# Altium schematic sheet Receiver_Design_PCB.SchDoc
size A3; SheetNumber: 1; SheetTotal: 1
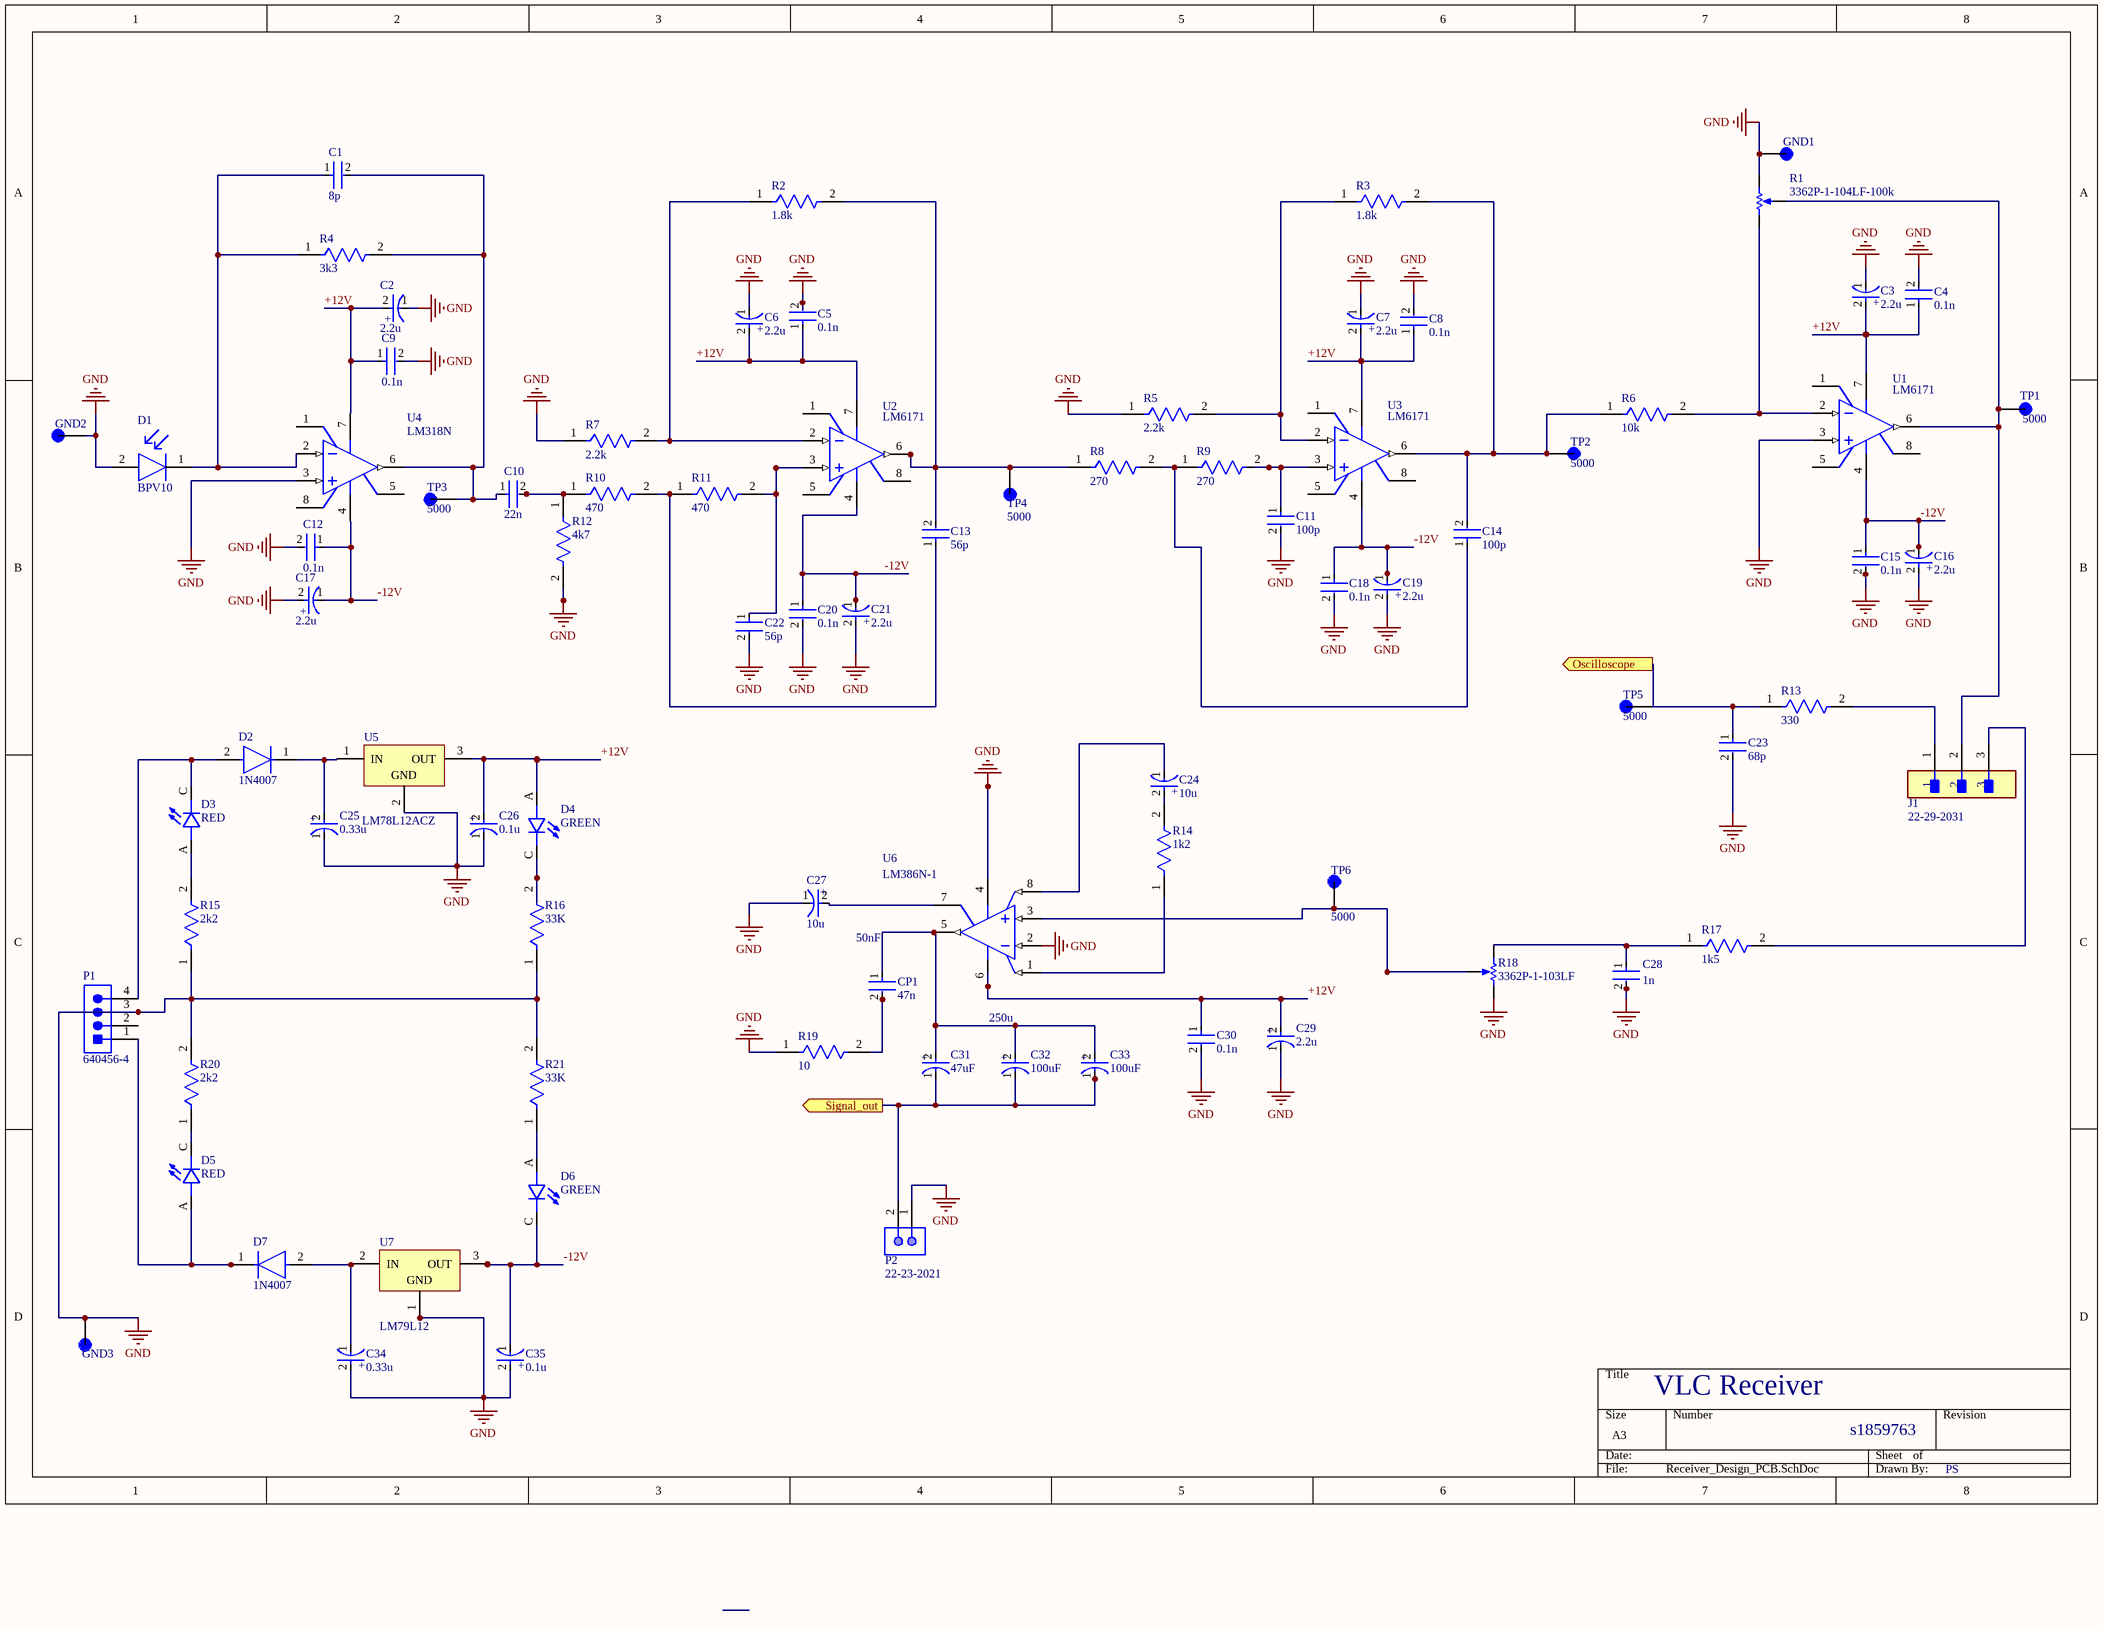
[diagram p0: Receiver_Design_PCB.SchDoc]

## Parts
C1  8p  [FP-K15H5-MFG]
C2  2.2u  [FP-TAP106K016SCS-MFG]
C3  2.2u  [FP-TAP106K016SCS-MFG]
C4  0.1n  [FP-K15H5-MFG]
C5  0.1n  [FP-K15H5-MFG]
C6  2.2u  [FP-TAP106K016SCS-MFG]
C7  2.2u  [FP-TAP106K016SCS-MFG]
C8  0.1n  [FP-K15H5-MFG]
C9  0.1n  [FP-K15H5-MFG]
C10  22n  [FP-K15H5-MFG]
C11  100p  [FP-K15H5-MFG]
C12  0.1n  [FP-K15H5-MFG]
C13  56p  [FP-K15H5-MFG]
C14  100p  [FP-K15H5-MFG]
C15  0.1n  [FP-K15H5-MFG]
C16  2.2u  [FP-TAP106K016SCS-MFG]
C17  2.2u  [FP-TAP106K016SCS-MFG]
C18  0.1n  [FP-K15H5-MFG]
C19  2.2u  [FP-TAP106K016SCS-MFG]
C20  0.1n  [FP-K15H5-MFG]
C21  2.2u  [FP-TAP106K016SCS-MFG]
C22  56p  [FP-K15H5-MFG]
C23  68p  [FP-K15H5-MFG]
C24  10u  [FP-RAD-TH-D_8_0_5-L_11_5-MFG]
C25  0.33u  [FP-TAP106K016SCS-MFG]
C26  0.1u  [FP-TAP106K016SCS-MFG]
C27  10u  [FP-RAD-TH-D_8_0_5-L_11_5-MFG]
C28  1n  [FP-K15H5-MFG]
C29  2.2u  [FP-TAP106K016SCS-MFG]
C30  0.1n  [FP-K15H5-MFG]
C31  47uF  [FP-RAD-TH-D_8_0_5-L_11_5-MFG]
C32  100uF  [FP-EEU-FR1H101B-MFG]
C33  100uF  [FP-EEU-FR1H101B-MFG]
C34  0.33u  [FP-TAP106K016SCS-MFG]
C35  0.1u  [FP-TAP106K016SCS-MFG]
CP1  47n  [FP-R82DC4100DQ60J-MFG]
D1  BPV10  [FP-6_544-5185_02-4-MFG]
D2  1N4007  [FP-1N4007-MFG]
D3  RED  [LEDRD254W57D500H1070]
D4  GREEN  [LEDRD254W57D500H1070]
D5  RED  [LEDRD254W57D500H1070]
D6  GREEN  [LEDRD254W57D500H1070]
D7  1N4007  [FP-1N4007-MFG]
GND1  (no value)  [KEYSTONE_5000]
GND2  (no value)  [KEYSTONE_5000]
GND3  (no value)  [KEYSTONE_5000]
J1  22-29-2031  [FP-22-29-2031-MFG]
P1  640456-4  [TECO-640456-4]
P2  22-23-2021  [MOLX-22-23-2021_V]
R1  3362P-1-104LF-100k  [BOUR-3362P]
R2  1.8k  [FP-MRS25-MFG]
R3  1.8k  [FP-MRS25-MFG]
R4  3k3  [FP-MRS25-MFG]
R5  2.2k  [FP-MRS25-MFG]
R6  10k  [FP-MRS25-MFG]
R7  2.2k  [FP-MRS25-MFG]
R8  270  [FP-MRS25-MFG]
R9  270  [FP-MRS25-MFG]
R10  470  [FP-MRS25-MFG]
R11  470  [FP-MRS25-MFG]
R12  4k7  [FP-MRS25-MFG]
R13  330  [FP-MRS25-MFG]
R14  1k2  [FP-MRS25-MFG]
R15  2k2  [FP-MRS25-MFG]
R16  33K  [FP-MRS25-MFG]
R17  1k5  [FP-MRS25-MFG]
R18  3362P-1-103LF  [BOUR-3362P]
R19  10  [FP-MRS25-MFG]
R20  2k2  [FP-MRS25-MFG]
R21  33K  [FP-MRS25-MFG]
TP1  5000  [KEYSTONE_5000]
TP2  5000  [KEYSTONE_5000]
TP3  5000  [KEYSTONE_5000]
TP4  5000  [KEYSTONE_5000]
TP5  5000  [KEYSTONE_5000]
TP6  5000  [KEYSTONE_5000]
U1  LM6171  [P0008A]
U2  LM6171  [P0008A]
U3  LM6171  [P0008A]
U4  LM318N  [P0008A]
U5  LM78L12ACZ  [TO220]
U6  LM386N-1  [TI-P8]
U7  LM79L12  [NDE0003A]

## Ports
Oscilloscope (out), Signal_out (out)

## Nets
GND: C2.1(C) C3.1(C) C4.2 C5.2 C6.1(C) C7.1(C) C8.2 C9.2 C11.2 C12.2 C15.2 C16.2(A) C17.2(A) C18.2 C19.2(A) C20.2 C21.2(A) C22.2 C23.2 C25.1(C) C26.1(C) C27.1(C) C28.2 C29.1(C) C30.2 C34.2(A) C35.2(A) D1.2(A) GND1.TP GND2.TP GND3.TP P1.3 P2.1 R1.3(CW) R5.1 R7.1 R12.2 R15.1 R16.1 R18.3(CW) R19.1 R20.2 R21.2 U1.3(IN+) U4.3(IN+) U5.2(GND) U6.2(IN-) U6.4(GND) U7.1(GND)
+12V: C2.2(A) C3.2(A) C4.1 C5.1 C6.2(A) C7.2(A) C8.1 C9.1 C26.2(A) C29.2(A) C30.1 D4.A U1.7(V+) U2.7(V+) U3.7(V+) U4.7(V+) U5.3(OUT) U6.6(VS)
-12V: C12.1 C15.1 C16.1(C) C17.1(C) C18.1 C19.1(C) C20.1 C21.1(C) C35.1(C) D6.C U1.4(V-) U2.4(V-) U3.4(V-) U4.4(V-) U7.3(OUT)
Oscilloscope: C23.1 R13.1 TP5.TP ; port Oscilloscope
Signal_out: C31.1(C) C32.1(C) C33.1(C) P2.2 ; port Signal_out
NetC1_1: C1.1 D1.1(C) R4.1 U4.2(IN-)
NetC1_2: C1.2 C10.1 R4.2 TP3.TP U4.6(OUT)
NetC10_2: C10.2 R10.1 R12.1
NetC11_1: C11.1 R9.2 U3.3(IN+)
NetC13_1: C13.1 R10.2 R11.1
NetC13_2: C13.2 R2.2 R8.1 TP4.TP U2.6(OUT)
NetC14_1: C14.1 R8.2 R9.1
NetC14_2: C14.2 R3.2 R6.1 TP2.TP U3.6(OUT)
NetC22_1: C22.1 R11.2 U2.3(IN+)
NetC24_1: C24.1(C) U6.8(GAIN)
NetC24_2: C24.2(A) R14.2
NetC25_2: C25.2(A) D2.1(C) U5.1(IN)
NetC27_2: C27.2(A) U6.7(BYPASS)
NetC28_1: C28.1 R17.1 R18.1(CCW)
NetC31_2: C31.2(A) C32.2(A) C33.2(A) CP1.1 U6.5(VOUT)
NetC34_1: C34.1(C) D7.2(A) U7.2(IN)
NetCP1_2: CP1.2 R19.2
NetD2_2: D2.2(A) D3.C P1.4
NetD3_A: D3.A R15.2
NetD4_C: D4.C R16.2
NetD5_A: D5.A D7.1(C) P1.1
NetD5_C: D5.C R20.1
NetD6_A: D6.A R21.1
NetJ1_1: J1.1 R13.2
NetJ1_2: J1.2 R1.2(S) TP1.TP U1.6(OUT)
NetJ1_3: J1.3 R17.2
NetR1_1: R1.1(CCW) R6.2 U1.2(IN-)
NetR2_1: R2.1 R7.2 U2.2(IN-)
NetR3_1: R3.1 R5.2 U3.2(IN-)
NetR14_1: R14.1 U6.1(GAIN)
NetR18_2: R18.2(S) TP6.TP U6.3(IN+)

Not connected (* = marked no-connect by the designer): P1 2; U1 1(NC) 5(NC) 8(NC); U2 1(NC) 5(NC) 8(NC); U3 1(NC) 5(NC) 8(NC); U4 1(BAL/COMP1) 5(BAL/COMP3) 8(COMP2)

## Notes on the sheet
- 50nF
- 250u
- VLC Receiver
- s1859763
- PS
- (in symbol CMP-04424-000616-1) +
- (in symbol CMP-05427-000020-1) +
- (in symbol CMP-05427-001162-1) +

## Library data of the parts
C1 C4 C5 C8-C12 C14 C15 C18 C20 C28 C30 = CMP-02417-000078-1: CAP CER 0.1UF 50V X7R RADIAL; Tolerance: 10%; Dielectric Material: Ceramic; Lead Length: 30mm; Lead Diameter: 0.5mm; Lead/Base Style: Formed Leads; Diameter: 500um; Max Operating Temperature: 125°C; Case/Package: Dipped; Dielectric: X7R; Lead Free: Lead Free; Construction: RADIAL; Voltage: 50V; Thickness: 2.6mm; Min Operating Temperature: -55°C; Lead Pitch: 5mm; Height: 4mm; Radiation Hardening: No; Voltage Rating: 50V; Depth: 2.5mm; Voltage Rating (DC): 50V; Package Quantity: 1; Weight: 0.005644oz; Series: K; Mount: Through Hole; Termination: Radial; Height - Seated (Max): 0.257inch; Length: 4mm; Packaging: Tape and Reel; Width: 2.5mm; RoHS Compliant: Yes
  C1: Capacitance: 8p
  C4 C5 C8 C9 C12 C15 C18 C20 C30: Capacitance: 0.1n
  C10: Capacitance: 22n
  C11 C14: Capacitance: 100p
  C28: Capacitance: 1n
C2 C3 C6 C7 C16 C17 C19 C21 C26 C29 C35 = CMP-04424-000616-1: CAP TANT 10UF 10% 16V RADIAL; Dissipation Factor: 8%; Dielectric Material: Tantalum; Leakage Current: 1.2uA; Polarity: Polar; Voltage: 35V; Life (Hours): 1000Hour; ESR (Equivalent Series Resistance): 3.2R; Lead Diameter: 0.5mm; Capacitance: 0.33u; Packaging: Bulk; Min Operating Temperature: -55°C; RoHS Compliant: Yes; Construction: RADIAL; Length: 9mm; Number of Pins: 2; Height - Seated (Max): 0.354inch; Termination: Radial; Tolerance: 10%; Case/Package: Dipped; Voltage Rating (DC): 16V; Voltage Rating: 16V; Lead Pitch: 2.5mm; Size: 9mm; Lead Free: Lead Free; Mount: Through Hole; Height: 9mm; Max Operating Temperature: 125°C; Features: General Purpose; Diameter: 5mm; Radiation Hardening: No; Package Quantity: 1000; Series: TAP
C13 C22 = CMP-02417-000078-1: CAP CER 0.1UF 50V X7R RADIAL; Capacitance: 100p; Tolerance: 10%; Dielectric Material: Ceramic; Lead Length: 30mm; Lead Diameter: 0.5mm; Lead/Base Style: Formed Leads; Diameter: 500um; Max Operating Temperature: 125°C; Case/Package: Dipped; Dielectric: X7R; Lead Free: Lead Free; Construction: RADIAL; Voltage: 50V; Thickness: 2.6mm; Min Operating Temperature: -55°C; Lead Pitch: 5mm; Height: 4mm; Radiation Hardening: No; Voltage Rating: 50V; Depth: 2.5mm; Voltage Rating (DC): 50V; Package Quantity: 1; Weight: 0.005644oz; Series: K; Mount: Through Hole; Termination: Radial; Height - Seated (Max): 0.257inch; Length: 4mm; Packaging: Tape and Reel; Width: 2.5mm; RoHS Compliant: Yes
C23 = CMP-02417-000078-1: CAP CER 0.1UF 50V X7R RADIAL; Capacitance: 22p; Tolerance: 10%; Dielectric Material: Ceramic; Lead Length: 30mm; Lead Diameter: 0.5mm; Lead/Base Style: Formed Leads; Diameter: 500um; Max Operating Temperature: 125°C; Case/Package: Dipped; Dielectric: X7R; Lead Free: Lead Free; Construction: RADIAL; Voltage: 50V; Thickness: 2.6mm; Min Operating Temperature: -55°C; Lead Pitch: 5mm; Height: 4mm; Radiation Hardening: No; Voltage Rating: 50V; Depth: 2.5mm; Voltage Rating (DC): 50V; Package Quantity: 1; Weight: 0.005644oz; Series: K; Mount: Through Hole; Termination: Radial; Height - Seated (Max): 0.257inch; Length: 4mm; Packaging: Tape and Reel; Width: 2.5mm; RoHS Compliant: Yes
C24 C27 C31 = CMP-05427-001162-1: Aluminum Electrolytic Capacitors (Radial Lead Type) AEC-Q200 Qualified 47uF ±20% 63V; Dissipation Factor: 0.08%; Lead Diameter: 0.6mm; Life (Hours): 2000Hour; Leakage Current: 3uA; Impedance: 342mR; Polarity: Polar; Ripple Current: 405mA; Termination: Radial; Lead Pitch: 5mm; RoHS Compliant: Yes; Radiation Hardening: No; Mount: Through Hole; Diameter: 8mm; Min Operating Temperature: -55°C; Packaging: Ammo Pack; Package Quantity: 1000; Length: 11.5mm; Voltage Rating (DC): 63V; Height: 11.5mm; Voltage Rating: 63V; Contact Plating: Tin; Ratings: AEC-Q200; Max Operating Temperature: 105°C; Case/Package: Radial; Tolerance: 20%; Series: FC; Height - Seated (Max): 0.492inch; ESR (Equivalent Series Resistance): 342mR
  C24 C27: Capacitance: 10u
  C31: Capacitance: 47uF
C25 C34 = CMP-04424-000616-1: CAP TANT 10UF 10% 16V RADIAL; Dissipation Factor: 8%; Dielectric Material: Tantalum; Leakage Current: 1.2uA; Polarity: Polar; Voltage: 35V; Life (Hours): 1000Hour; ESR (Equivalent Series Resistance): 3.2R; Lead Diameter: 0.5mm; Packaging: Bulk; Min Operating Temperature: -55°C; RoHS Compliant: Yes; Construction: RADIAL; Length: 9mm; Number of Pins: 2; Height - Seated (Max): 0.354inch; Termination: Radial; Tolerance: 10%; Case/Package: Dipped; Voltage Rating (DC): 16V; Voltage Rating: 16V; Lead Pitch: 2.5mm; Size: 9mm; Lead Free: Lead Free; Mount: Through Hole; Height: 9mm; Max Operating Temperature: 125°C; Features: General Purpose; Diameter: 5mm; Radiation Hardening: No; Package Quantity: 1000; Series: TAP; Capacitance: 0.33u
C32 C33 = CMP-05427-000020-1: CAP ALUM 100UF 20% 50V RADIAL; Life (Hours): 6000Hour; Ripple Current: 870mA; Lead Diameter: 0.6mm; Impedance: 61mR; Tolerance: 20%; Mount: Through Hole; Lead Free: Lead Free; Length: 11.5mm; Height - Seated (Max): 0.512inch; Contact Plating: Tin; Termination: Radial; Series: FR; Max Operating Temperature: 105°C; Features: General Purpose; Min Operating Temperature: -40°C; RoHS Compliant: Yes; Height: 11.5mm; Voltage Rating (DC): 50V; Diameter: 8mm; Capacitance: 100uF; Lead Pitch: 5mm; Radiation Hardening: No; Package Quantity: 1; Case/Package: Radial; Voltage Rating: 50V; Packaging: Tape and Reel; ESR (Equivalent Series Resistance): 61mR; REACH SVHC: No SVHC
CP1 = CMP-03022-000017-1: CAP FILM 1UF 5% 63VDC RADIAL; Voltage Rating (DC): 63V; Lead Diameter: 0.5mm; Insulation Resistance: 30R; Dielectric: PET; Voltage Rating (AC): 40V; Dissipation Factor: 80%; Life (Hours): 2000Hour; Mount: Through Hole; Case/Package: Radial; Package Quantity: 1700; Construction: RADIAL; Capacitance: 1uF; Lead Pitch: 5mm; Depth: 5mm; Series: R82; Packaging: Tape and Reel; RoHS Compliant: Yes; Voltage Rating: 63V; Height - Seated (Max): 0.398inch; Voltage: 63V; Radiation Hardening: No; Width: 5mm; REACH SVHC: No SVHC; Min Operating Temperature: -55°C; Tolerance: 5%; Dielectric Material: PET; Contact Plating: Tin; Termination: Radial; Length: 7.2mm; Max Operating Temperature: 105°C; Type: General Purpose
D1 = CMP-02531-000005-1: SENSOR PHOTODIODE 940NM RADIAL; Manufacturer: Vishay; Standoff Height: 2.6mm; Wavelength: 920nm; Response Time: 2.5ns; Power Dissipation: 215mW; Reverse Breakdown Voltage: 60V; Forward Voltage: 1V; Viewing Angle: 40°; Forward Current: 50mA; Dark Current: 0.001uA; Max Junction Temp: +100°C; Device Class L3: Photodiodes; Manufacturer Part Number: BPV10; RoHS: TRUE; Digikey Description: SENSOR PHOTODIODE 940NM RADIAL; Device Class L1: Sensors; Package: 6.544-5185.02-4; Temperature Range High: +100°C; Sensor Output: Photodiode; Temperature Range Low: -40°C; Height: 12.1mm; Lead Free: Yes; Automotive: No; ComponentLink2Description: Datasheet; Device Class L2: Optical Sensors; ComponentLink2URL: http://www.vishay.com/docs/81502/bpv10.pdf; Octopart: https://octopart.com/bpv10-vishay-39728465; Ambient Temperature Range Low: -40°C; Category: Diode; Temperature: -40°C to +100°C; Mouser Description: Photodiodes 10V 215mW 875nm; Ambient Temperature Range High: +100°C
D2 D7 = CMP-123542-000001-1: Rectifier diode 1000 V 1 A DO-41, ,; Manufacturer: Diotec; Max Surge Forward Current: 27A; Forward Current: 1A; Max Junction Temp: +175°C; Reverse Voltage: 1000V; Value: 15pF; Peak Reverse Current: 5uA; Category: Diode; Temperature Range Low: -50°C; Automotive: No; Temperature: -50°C to +175°C; Lead Free: Yes; ComponentLink2Description: Datasheet; Max Repetitive Reverse Voltage: 1000V; ComponentLink2URL: https://datasheet.octopart.com/1N4007-Diotec-datasheet-62346875.pdf; Manufacturer Part Number: 1N4007; Device Class L3: Rectifier Diodes; Height: 2.8mm; Octopart: https://octopart.com/1n4007-diotec-4040411; Package: 1N4007; Temperature Range High: +175°C; Device Class L1: Discrete Semiconductors; Device Class L2: Diodes; RoHS: TRUE; Capacitance: 15pF; Ipc Land Pattern Name: DIOAD888W100L520D280
D3-D6 = L08R5000Q1: LED, 5MM, ORANGE; LED / Lamp Size: 5mm / T-1 3/4; LED Colour: Orange; Typ Luminous Intensity: 4.3mcd; Viewing Angle: ...; MF: LED Technology; Value: *; SnapEDA_Link: https://www.snapeda.com/parts/L08R5000Q1/LED+Technology/view-part/?ref=snap; MP: L08R5000Q1; Check_prices: https://www.snapeda.com/parts/L08R5000Q1/LED+Technology/view-part/?ref=eda; Availability: In Stock; Price: None; Package: None
  D4: Lead Pitch: 2.54
  D6: Lead Pitch: 2.54mm
GND1-GND3 TP1-TP6 = 5000: Test Point Miniature THM H .300 Nylon 46 Insulated Red PhosBronze/Silver | Keystone Electronics 5000; SnapEDA_Link: https://www.snapeda.com/parts/5000/Keystone+Electronics/view-part/?ref=snap; Package: Test Point Keystone Electronics; Value: *; MF: Keystone Electronics; MP: 5000; Check_prices: https://www.snapeda.com/parts/5000/Keystone+Electronics/view-part/?ref=eda
J1 = CMP-04776-000327-1: CONN HEADER VERT 3POS 2.54MM; Contact Resistance: 10mR; Number of Positions: 3; Voltage Rating: 250V; Gender: Male; Connector Type: Male Pin; Current Rating: 4A; Packaging: Bulk; Housing Material: Nylon; Min Operating Temperature: 0°C; Color: Natural; RoHS Compliant: Yes; Housing Color: White; Number of Rows: 1; Pitch: 2.54mm; Mount: Through Hole; Fastening Type: Friction; Length: 7.62mm; Depth: 5.8mm; Contact Material: Brass; Max Operating Temperature: 75°C; Number of Contacts: 3; Contact Type: Male Pin; Working Voltage: 250V; Orientation: Straight; Lead Pitch: 2.54mm; Radiation Hardening: No; Termination: Solder; Contact Plating: Gold; Contact Mating Length: 0.295inch; Series: KK® 6410
P1 = CMP-2000-05419-1: Male Header, Pitch 2.54 mm, 1 x 4 Position, Height 10.03 mm, Tail Length 3.56 mm, RoHS, Bulk; Manufacturer: TE Connectivity; Material, Housing: Polyester; Primary Type: InterconnectSystem; Mount Angle: Vertical; Color, Housing: White; Current, Rating: 5 / A; Agency Approvals: CSA,UL; Contact Termination Area Plating: Tin; Temperature, Operating: -55to+105 / degC; Standards: RoHSCompliant,ELVCompliant,UL94V-0; Number of Positions: 4; Brand/Series: MTA-100Series; Angle: Straight; Pin Spacing: 0.1 / "; Material, Contact: CopperAlloy; Connector Type: MTA-100; Special Features: Pinstrip; Mounting Hole Size: 0.04 / "; Contact Centerline Spacing: 0.100 / in.; Voltage, Rating: 250 / V; Manufacturer URL: http://www.te.com/; Length, Pin: 0.14 / "; Length, Overall: 0.4 / "; Color: White; Flammability Rating: UL94V-0; Mounting Type: PCMount; Termination: Solder; Datasheet URL: https://datasheet.ciiva.com/16286/eng-ds-82056-mta-0608-16286228.pdf; Number of Contacts: 4; Contact Shape: Square; Contact Mating Area Plating: Tin; Length, Terminal Post: 0.14 / in.; Size, Post: 0.025 / in.; Contact Plating: Tin; Type: PCBPlug; Datasheet Version: Dec-14; Number of Rows: 1
P2 = CMP-1704-00001-3: Male Header, Pitch 2.54 mm, 1 x 2 Position, Height 10.67 mm, Tail Length 3.56 mm, 0 to 75 degC, RoHS, Bulk; Package Quantity: 3000; Height: 10.67 mm; RoHSCompliant: True; ComponentLink2URL: https://datasheet.ciiva.com/19454/232266-19454304.pdf; PartNumber: 22-23-2021; Packaging: Bulk; ComponentLink2Description: Datasheet; Min Operating Temperature: 0 degC; ComponentLink1Description: Manufacturer URL; Length: 5.08 mm; Mounting Technology: Through Hole; Max Operating Temperature: 75 degC; REACH SVHC: Unknown; PackageDescription: Male Header, Pitch 2.54 mm, 1 x 2 Position, Height 10.67 mm, Tail Length 3.56 mm; ComponentLink1URL: http://www.molex.com/; Mount: Through Hole; Radiation Hardening: No; Width: 6.35 mm; Pins: 2
R1 R18 = CMP-1747-00004-1: Square Trimpot(R) Trimming Potentiometer, 10 KOhm, 300 V, -55 to 125 degC, 3-Pin THD, RoHS, Tube; Voltage Rating: 220 mV; Power Rating: 1 W; Tolerance: 1%; Resistance: 50 mohm; Case/Package: 1206; Length: 3.2 mm; RoHSCompliant: True; PackageDescription: 3-Pin Through Hole Device, Body 6.6 x 6.99 mm, Pitch 2.54 mm; ComponentLink2Description: Datasheet; REACH SVHC: No SVHC; Mount: Surface Mount; Height: 0.6 mm; Packaging: Tape and Reel; ComponentLink1URL: http://www.bourns.com/; Case Code (Imperial): 0612; Pins: 2; Case Code (Metric): 1632; ComponentLink2URL: http://www.bourns.com/docs/Product-Datasheets/3362.pdf; Min Operating Temperature: -25degC; ComponentLink1Description: Manufacturer URL; PackageReference: 3326P; Max Operating Temperature: 125degC; Width: 1.6 mm; Package Quantity: 5000; DatasheetVersion: May-16
R2-R17 R19-R21 = CMP-02408-000051-1: RES 1K OHM 0.6W 1% AXIAL; Power Rating: 600mW; Lead Diameter: 0.6mm; Voltage Rating (DC): 350V; Resistance: 1kR; Temperature Coefficient: 50ppm/°C; Width: 2.5mm; Military Standard: Not; Package Quantity: 5000; Radiation Hardening: No; Case/Package: Axial; Resistance Tolerance: 1%; Resistor Type: Metal Film; Contact Plating: Tin; Length: 6.5mm; Lead Free: Lead Free; RoHS Compliant: Yes; Mount: Through Hole; Number of Pins: 2; Technology: THIN FILM; Voltage Rating: 350V; Min Operating Temperature: -55°C; Weight: 0.00776oz; Diameter: 2.5mm; Construction: Cylindrical; Series: MRS25; Tolerance: 1%; Packaging: Tape and Reel; Max Operating Temperature: 155°C; Max Power Dissipation: 600mW; Number of Terminations: 2; Termination: Axial
U1-U3 = CMP-0055-00139-3: High Speed Low Power Low Distortion Voltage Feedback Amplifier, 8-pin MDIP, Pb-Free; Manufacturer: Texas Instruments; CompType: Amplifiers; PackageTopMarking: NSUZXYTTE#*LM6171*BIN; PowerWise: Y; PackageDescription: MDIP, .365 x .250 x .130in, 8 Lead, .100in Pitch; Code_JEDEC: MS-001-BA; Package Reference: P0008A; RoHS: Y; ComponentLink1Description: Datasheet URL; PinCount: 8; ComponentLink1URL: http://www.ti.com/general/docs/lit/getliterature.tsp?genericPartNumber=LM6171&fileType=pdf
U4 = CMP-0055-00106-3: Operational Amplifier, 8-pin MDIP; Manufacturer: Texas Instruments; CompType: Amplifiers; PackageTopMarking: NSUZXYTTE#*LM*318N; PowerWise: N; RoHS: N; ComponentLink1Description: Datasheet URL; Package Reference: P0008A; ComponentLink1URL: http://www.ti.com/general/docs/lit/getliterature.tsp?genericPartNumber=LM318-N&fileType=pdf; PackageDescription: MDIP, .365 x .250 x .130in, 8 Lead, .100in Pitch; PinCount: 8; Code_JEDEC: MS-001-BA
U5 = CMP-0244-00483-1: Positive Voltage Regulator, 5V, 3-Pin TO-220; PackageDescription: TO, Thru-Hole, Vertical, Heatsink Mounted; 3 In-Line Leads; Pitch 2.54 mm; ComponentLink2Description: Datasheet; PackageReference: TO220; ComponentLink3URL: http://www.st.com/internet/com/TECHNICAL_RESOURCES/TECHNICAL_LITERATURE/PACKAGE_INFORMATION/CD00004649.pdf; DatasheetVersion: 16/11/2011; ComponentLink1Description: Manufacturer URL; ComponentLink1URL: http://www.st.com; PackageVersion: ver3.0; ComponentLink3Description: Package Specification; ComponentLink2URL: http://www.st.com/internet/com/TECHNICAL_RESOURCES/TECHNICAL_LITERATURE/DATASHEET/CD00000444.pdf
U6 = CMP-0057-00051-3: Low Voltage Audio Power Amplifier, 0 to 70 degC, 8-pin DIP (P8); Manufacturer: Texas Instruments; Input Type: Analog; SubFamily: Mid/High-Power Amplifier; Max. Number of Speaker Outputs: 1; PartNumber: LM386N-1; ComponentLink2Description: Datasheet; Mounting Technology: Through Hole; Code_JEDEC: MS-001; PackageReference: P8; ComponentLink3Description: Package Specification; ComponentLink3URL: http://www.ti.com/litv/pdf/mpdi001b; PackageDescription: 8-Pin Plastic In-Line, Body 9.59 x 6.35 mm, Pitch 2.54 mm; ComponentLink1Description: Manufacturer URL; ComponentLink1URL: http://www.ti.com/; PackageVersion: 4040082/E, 04/2010; ComponentLink2URL: http://www.ti.com/general/docs/lit/getliterature.tsp?genericPartNumber=LM386&fileType=pdf; DatasheetVersion: SNAS545A
U7 = CMP-0062-02473-3: 3-Terminal Negative Regulator, 3-pin TO-220, Pb-Free; Manufacturer: Texas Instruments; PackageTopMarking: NSUZXYTTE#*LM7912CT; CompType: LDO IC; PowerWise: N; RoHS: Y; PackageDescription: TO-220, Molded, 3 Lead, Straight; PackageReference: NDE0003A; PinCount: 3; ComponentLink1URL: http://www.ti.com/general/docs/lit/getliterature.tsp?genericPartNumber=LM7912&fileType=pdf; ComponentLink1Description: Datasheet URL